# EAGLE schematic Paralelo74595_DualDisp (EAGLE 9.6.2)
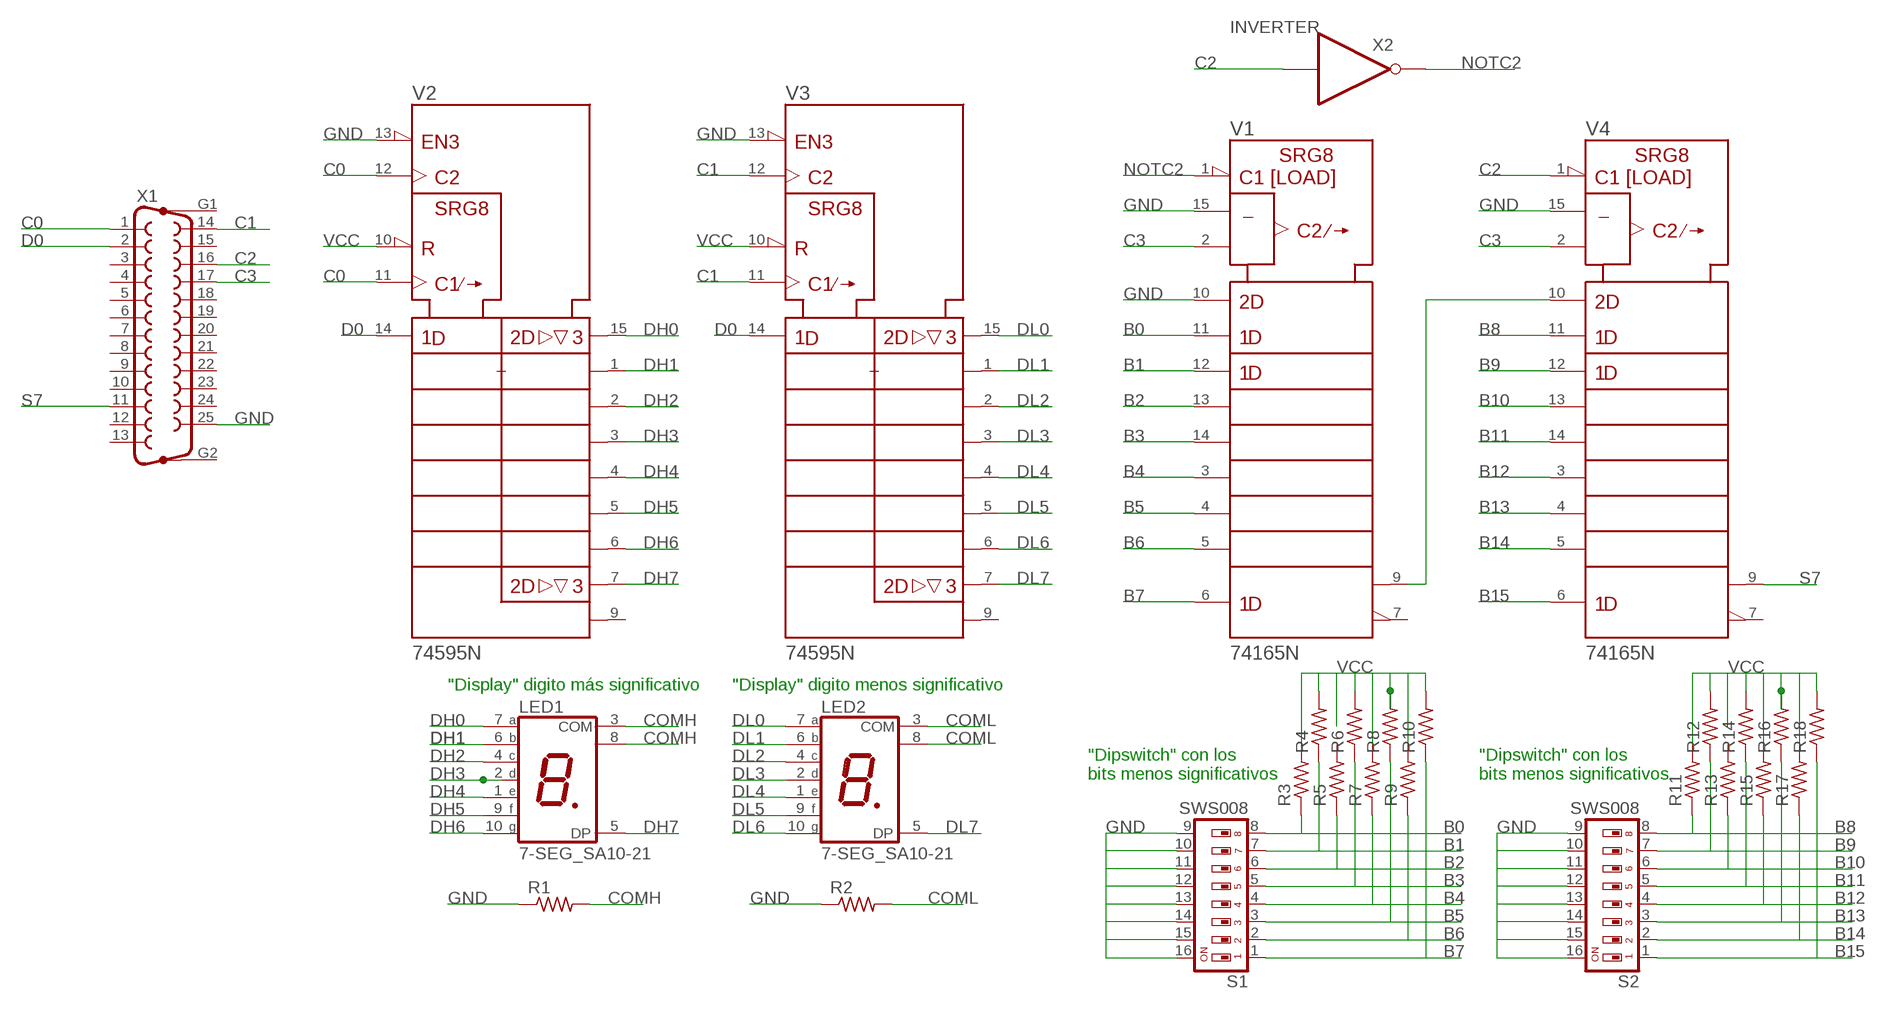
[diagram p0: schematic, sheet 1]

## Parts
LED1  7-SEG_SA10-21  [SA10-21]
LED2  7-SEG_SA10-21  [SA10-21]
R1  R-US_0204/5  [0204/5]
R2  R-US_0204/5  [0204/5]
R3  R-US_0207/12  [0207/12]
R4  R-US_0207/12  [0207/12]
R5  R-US_0207/12  [0207/12]
R6  R-US_0207/12  [0207/12]
R7  R-US_0207/12  [0207/12]
R8  R-US_0207/12  [0207/12]
R9  R-US_0207/12  [0207/12]
R10  R-US_0207/12  [0207/12]
R11  R-US_0207/12  [0207/12]
R12  R-US_0207/12  [0207/12]
R13  R-US_0207/12  [0207/12]
R14  R-US_0207/12  [0207/12]
R15  R-US_0207/12  [0207/12]
R16  R-US_0207/12  [0207/12]
R17  R-US_0207/12  [0207/12]
R18  R-US_0207/12  [0207/12]
S1  SWS008  [SMS-008]
S2  SWS008  [SMS-008]
V1  74165N  [DIL16]
V2  74595N  [DIL16]
V3  74595N  [DIL16]
V4  74165N  [DIL16]
X1  F25HP  [F25HP]
X2  INVERTER  (no package)

## Nets
B0: R3.1 S1.8 V1.11(A)
B1: R4.1 S1.7 V1.12(B)
B2: R5.1 S1.6 V1.13(C)
B3: R6.1 S1.5 V1.14(D)
B4: R7.1 S1.4 V1.3(E)
B5: R8.1 S1.3 V1.4(F)
B6: R9.1 S1.2 V1.5(G)
B7: R10.1 S1.1 V1.6(H)
B8: R11.1 S2.8 V4.11(A)
B9: R12.1 S2.7 V4.12(B)
B10: R13.1 S2.6 V4.13(C)
B11: R14.1 S2.5 V4.14(D)
B12: R15.1 S2.4 V4.3(E)
B13: R16.1 S2.3 V4.4(F)
B14: R17.1 S2.2 V4.5(G)
B15: R18.1 S2.1 V4.6(H)
C0: V2.11(SRCK) V2.12(RCK) X1.1
C1: V3.11(SRCK) V3.12(RCK) X1.14
C2: V4.1(SH/!LD) X1.16 X2.I
C3: V1.2(CLK) V4.2(CLK) X1.17
COMH: LED1.3(COM) LED1.8(COM) R1.2
COML: LED2.3(COM) LED2.8(COM) R2.2
D0: V2.14(SER) V3.14(SER) X1.2
DH0: LED1.7(A) V2.15(QA)
DH1: LED1.6(B) V2.1(QB)
DH2: LED1.4(C) V2.2(QC)
DH3: LED1.2(D) V2.3(QD)
DH4: LED1.1(E) V2.4(QE)
DH5: LED1.9(F) V2.5(QF)
DH6: LED1.10(G) V2.6(QG)
DH7: LED1.5(DP) V2.7(QH)
DL0: LED2.7(A) V3.15(QA)
DL1: LED2.6(B) V3.1(QB)
DL2: LED2.4(C) V3.2(QC)
DL3: LED2.2(D) V3.3(QD)
DL4: LED2.1(E) V3.4(QE)
DL5: LED2.9(F) V3.5(QF)
DL6: LED2.10(G) V3.6(QG)
DL7: LED2.5(DP) V3.7(QH)
GND: R1.1 R2.1 S1.9 S1.10 S1.11 S1.12 S1.13 S1.14 S1.15 S1.16 S2.9 S2.10 S2.11 S2.12 S2.13 S2.14 S2.15 S2.16 V1.10(SER) V1.15(CLK_INH) V2.13(!G) V3.13(!G) V4.15(CLK_INH) X1.25
N$1: V1.9(QH) V4.10(SER)
NOTC2: V1.1(SH/!LD) X2.O
S7: V4.9(QH) X1.11
VCC: R3.2 R4.2 R6.2 R7.2 R8.2 R9.2 R10.2 R11.2 R12.2 R14.2 R15.2 R16.2 R17.2 R18.2 V2.10(!SRCLR) V3.10(!SRCLR)
Unconnected: R5.2 R13.2 V1.7(!QH) V2.9(QH*) V3.9(QH*) V4.7(!QH) X1.3 X1.4 X1.5 X1.6 X1.7 X1.8 X1.9 X1.10 X1.12 X1.13 X1.15 X1.18 X1.19 X1.20 X1.21 X1.22 X1.23 X1.24 X1.G1 X1.G2

## Notes on the sheet
- "Display" digito más significativo | "Display" digito menos significativo
- "Dipswitch" con los
  bits menos significativos
- "Dipswitch" con los
  bits menos significativos

## Power pins joined to a net without a drawn wire
+UB: V1.16(+UB) V2.16(+UB) V3.16(+UB) V4.16(+UB)
-UB: V1.8(-UB) V2.8(-UB) V3.8(-UB) V4.8(-UB)

## Library data of the parts
LED1 LED2 = display-kingbright:7-SEG_: Kingbright 14.2mm (0.56 INCH) SINGLE DIGIT NUMERIC DUISPLAY Source: SA56-11EWA(Ver1189471036.pdf; OC_FARNELL: unknown; OC_NEWARK: unknown
R1-R18 = resistor:R-US_: RESISTOR, American symbol
S1 S2 = smd-special:SWS008: SMD Dip Switch 8 pol.
V1 V4 = 74ttl-din:74*165: 8-bit parallel load SHIFT REGISTER
V2 V3 = 74ttl-din:74*595: 8-bit SHIFT REGISTER, output latch
X1 = con-subd:F25HP: SUB-D; OC_FARNELL: unknown; OC_NEWARK: unknown
X2 = ngspice-digital:INVERTER: logic inverter (NOT gate)